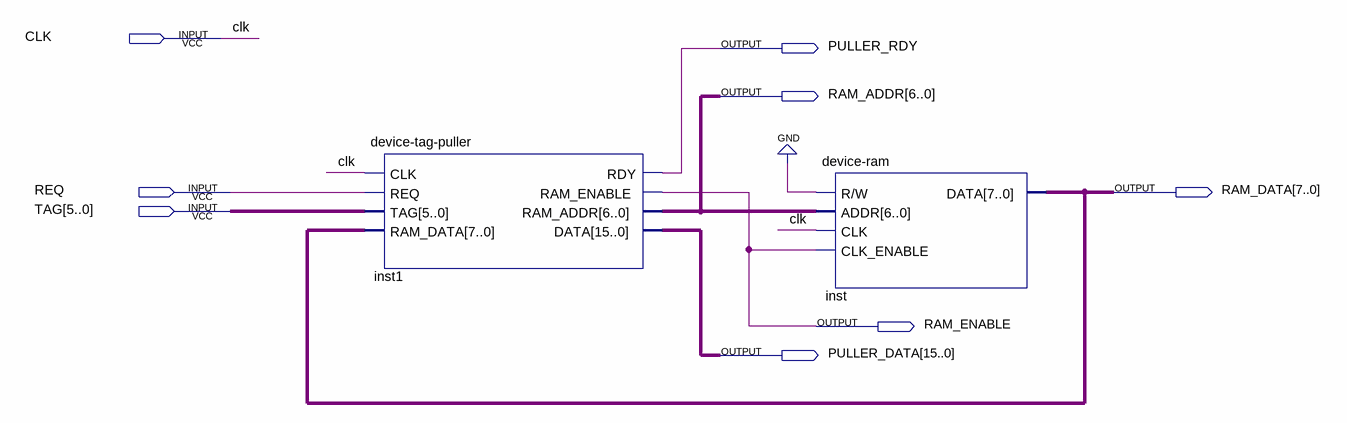
[diagram p0: schematic sheet]
// Quartus schematic device-tag-puller-test.bdf as structural Verilog: 2 symbols, 8 pins
module \device-tag-puller-test  (
  input  CLK,
  input  REQ,
  input  [5:0] TAG,
  output PULLER_RDY,
  output [6:0] RAM_ADDR,
  output [7:0] RAM_DATA,
  output RAM_ENABLE,
  output [15:0] PULLER_DATA
);

  \device-tag-puller  inst1 (
    .CLK(CLK), .REQ(REQ), .TAG(TAG), .RAM_DATA(RAM_DATA), .RDY(PULLER_RDY), .RAM_ENABLE(RAM_ENABLE),
    .RAM_ADDR(RAM_ADDR), .DATA(PULLER_DATA));
  \device-ram  inst (.\R/W (1'b0), .ADDR(RAM_ADDR), .CLK(CLK), .CLK_ENABLE(RAM_ENABLE), .DATA(RAM_DATA));
endmodule
